# EAGLE schematic untitled (EAGLE 8.0.1)
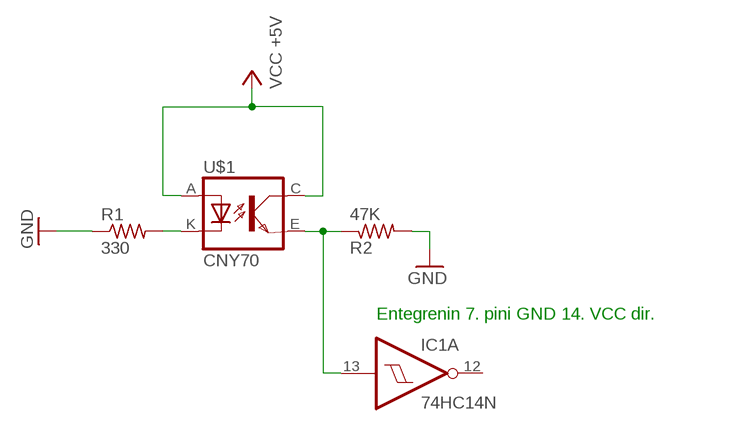
[diagram p0: schematic, sheet 1]

## Parts
IC1  74HC14N  [DIL14]
R1  330  R-US_0204/5  [0204/5]
R2  47K  R-US_0204/5  [0204/5]
U$1  CNY70  [4]

## Nets
GND: R1.1 R2.2
N$1: IC1.13(A:I) R2.1 U$1.E(EMI)
N$2: R1.2 U$1.K(C)
VCC: U$1.A U$1.C(COL) ; supply symbol labelled VCC +5V
Unconnected: IC1.1(D:I) IC1.2(D:O) IC1.3(E:I) IC1.4(E:O) IC1.5(F:I) IC1.6(F:O) IC1.8(C:O) IC1.9(C:I) IC1.10(B:O) IC1.11(B:I) IC1.12(A:O)

## Notes on the sheet
- Entegrenin 7. pini GND 14. VCC dir.

## Power pins joined to a net without a drawn wire
GND: IC1.7(P:GND)
VCC: IC1.14(P:VCC)

## Library data of the parts
IC1 = 74xx-eu:74*14: Hex schmitt trigger INVERTER
R1 R2 = resistor:R-US_: RESISTOR, American symbol
U$1 = cny70:CNY70